# Altium project GBA.PrjPcb (part 4 of 4)

## Sheet [05] - Power.SchDoc
size A3; DocumentNumber: 6; SheetNumber: 5; SheetTotal: 9
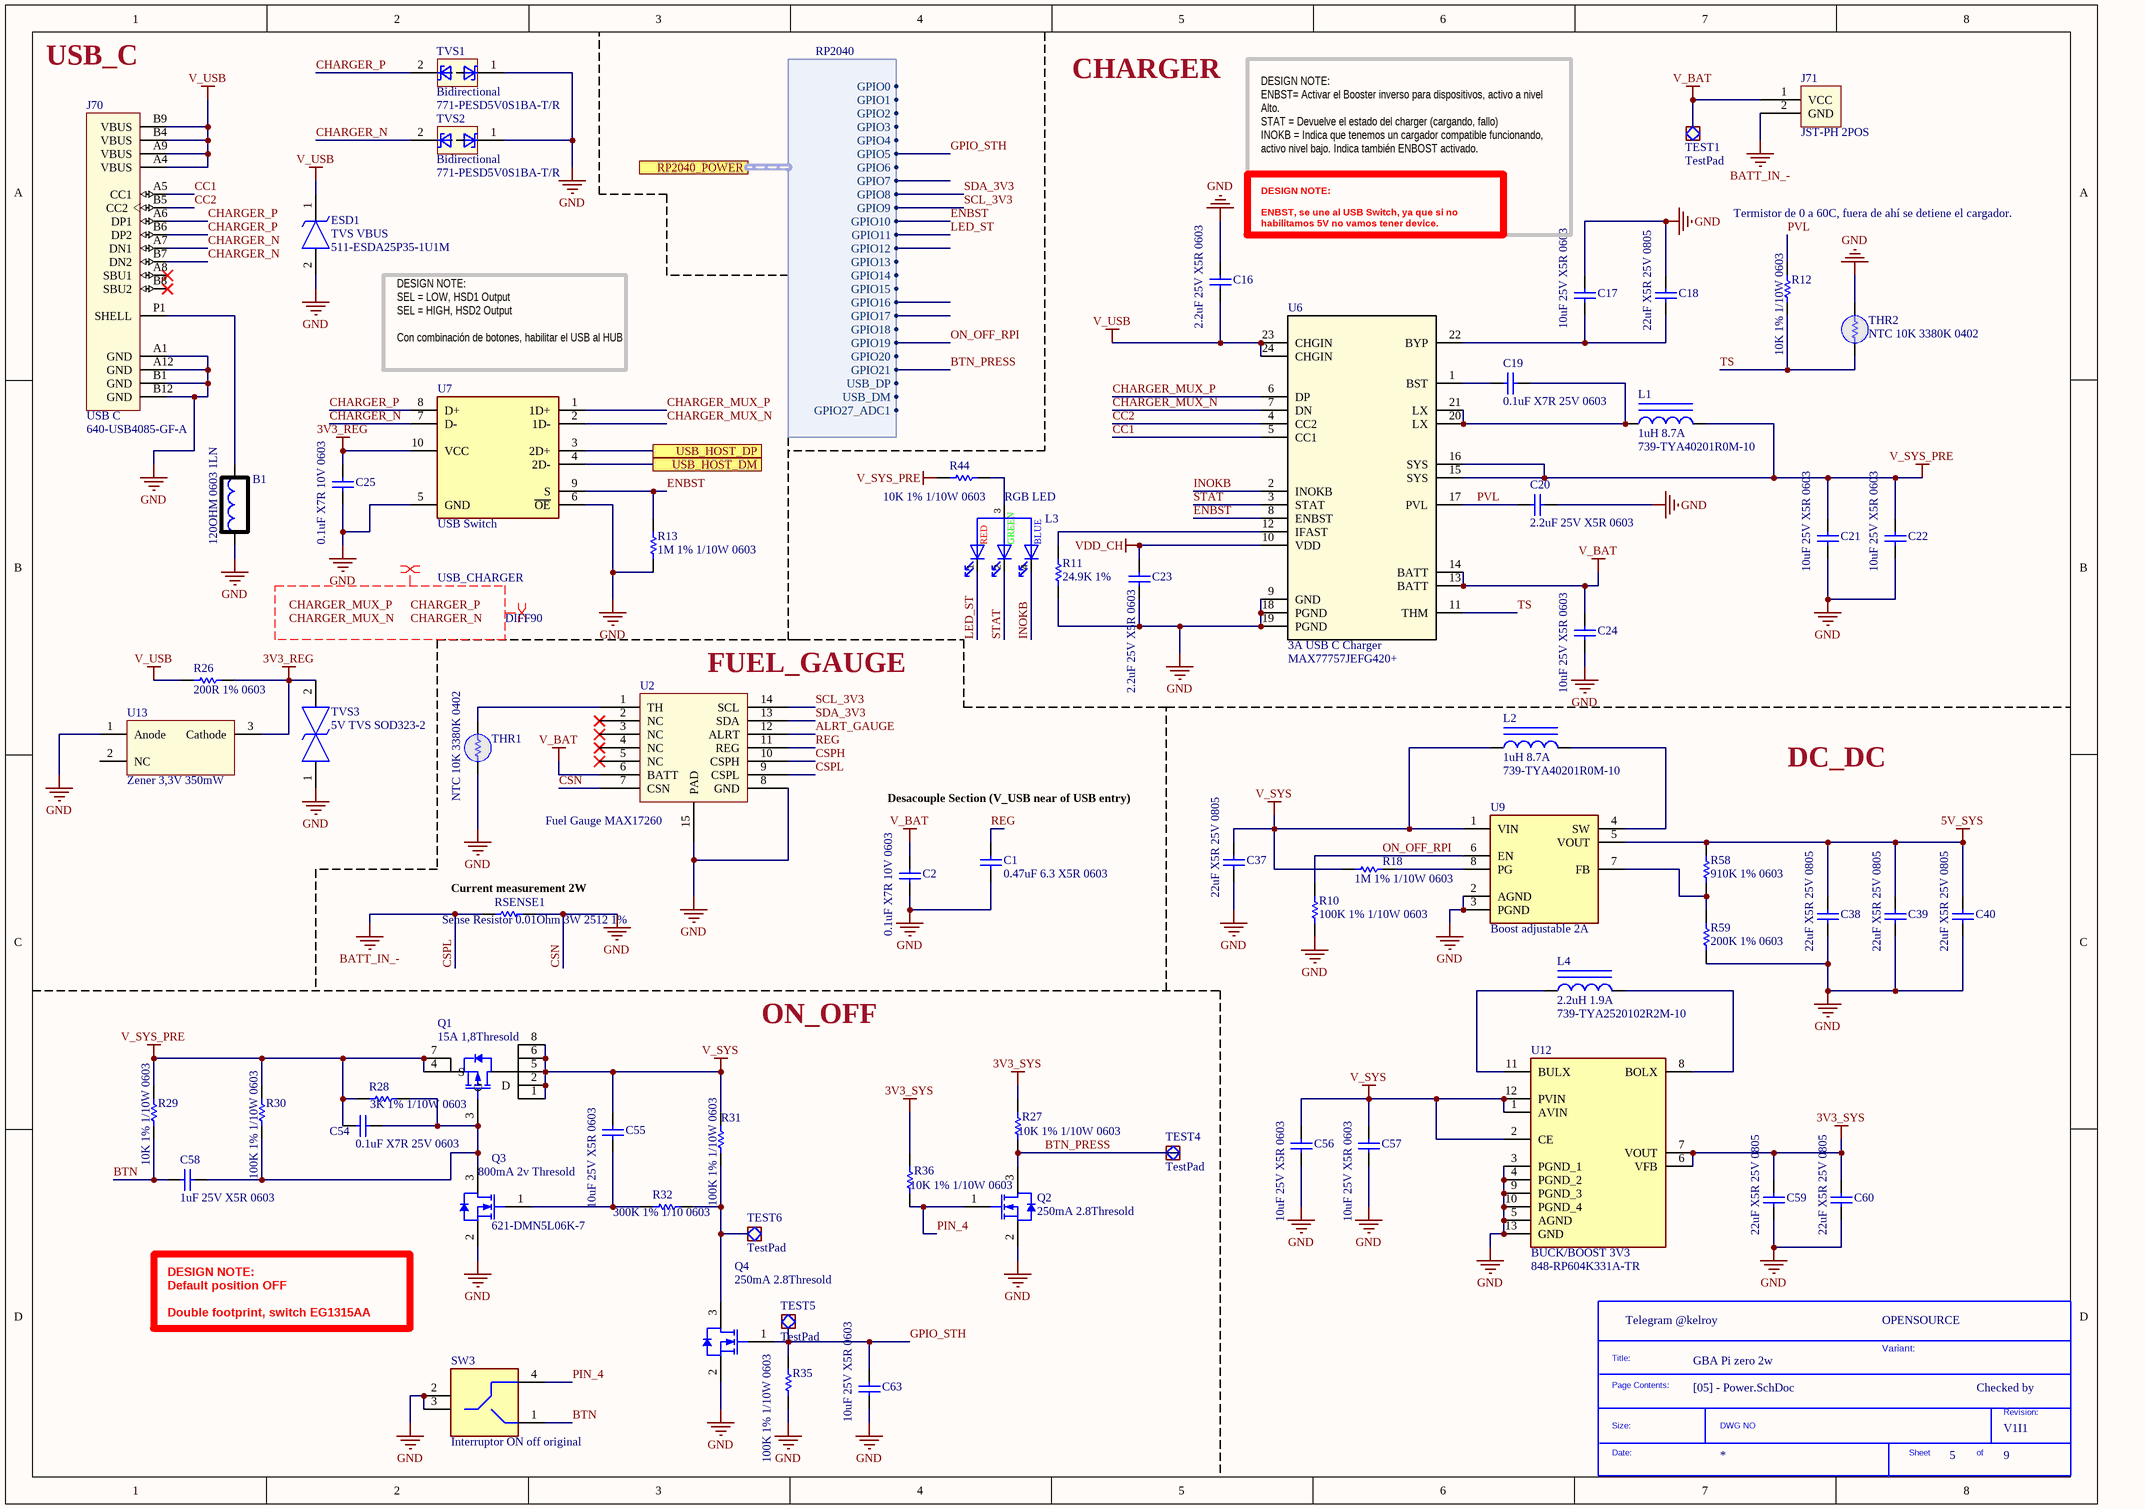
[diagram p8: [05] - Power.SchDoc]

### Parts
*?  SDTitleBlock  (value not drawn)  (graphical)
B1  120OHM 0603 1LN  [R 0603/1608]
C1  0.47uF 6.3 X5R 0603  [C 0603/1608]
C2  0.1uF X7R 10V 0603  [C 0603/1608]
C16  2.2uF 25V X5R 0603  [C 0603/1608]
C17  10uF 25V X5R 0603  [C 0603/1608]
C18  22uF X5R 25V 0805  [C 0805/2012]
C19  0.1uF X7R 25V 0603  [C 0603/1608]
C20  2.2uF 25V X5R 0603  [C 0603/1608]
C21  10uF 25V X5R 0603  [C 0603/1608]
C22  10uF 25V X5R 0603  [C 0603/1608]
C23  2.2uF 25V X5R 0603  [C 0603/1608]
C24  10uF 25V X5R 0603  [C 0603/1608]
C25  0.1uF X7R 10V 0603  [C 0603/1608]
C37  22uF X5R 25V 0805  [C 0805/2012]
C38  22uF X5R 25V 0805  [C 0805/2012]
C39  22uF X5R 25V 0805  [C 0805/2012]
C40  22uF X5R 25V 0805  [C 0805/2012]
C54  0.1uF X7R 25V 0603  [C 0603/1608]
C55  10uF 25V X5R 0603  [C 0603/1608]
C56  10uF 25V X5R 0603  [C 0603/1608]
C57  10uF 25V X5R 0603  [C 0603/1608]
C58  1uF 25V X5R 0603  [C 0603/1608]
C59  22uF X5R 25V 0805  [C 0805/2012]
C60  22uF X5R 25V 0805  [C 0805/2012]
C63  10uF 25V X5R 0603  [C 0603/1608]
ESD1  TVS VBUS  Supplier Part Number 1: 511-ESDA25P35-1U1M  [ESDA8P801U1M]
J70  USB C  Supplier Part Number 1: 640-USB4085-GF-A  [GCT_USB4085-GF-A_REVA]
J71  JST-PH 2POS  [S2B-PH]
L1  1uH 8.7A  Supplier Part Number 1: 739-TYA40201R0M-10  [TYA40201R0M10]
L2  1uH 8.7A  Supplier Part Number 1: 739-TYA40201R0M-10  [TYA40201R0M10]
L3  RGB LED  [IN-S66TATRGB]
L4  2.2uH 1.9A  Supplier Part Number 1: 739-TYA2520102R2M-10  [TYA2520102R2M10]
Q1  15A 1,8Thresold  [DMP1009UFDF-7]
Q2  250mA 2.8Thresold  [SOT-23-3]
Q3  800mA 2v Thresold  Supplier Part Number 1: 621-DMN5L06K-7  [SOT-23-3]
Q4  250mA 2.8Thresold  [SOT-23-3]
R10  100K 1% 1/10W 0603  [R 0603/1608]
R11  24.9K 1%  [R 0603/1608]
R12  10K 1% 1/10W 0603  [R 0603/1608]
R13  1M 1% 1/10W 0603  [R 0603/1608]
R18  1M 1% 1/10W 0603  [R 0603/1608]
R26  200R 1% 0603  [R 0603/1608]
R27  10K 1% 1/10W 0603  [R 0603/1608]
R28  3K 1% 1/10W 0603  [R 0603/1608]
R29  10K 1% 1/10W 0603  [R 0603/1608]
R30  100K 1% 1/10W 0603  [R 0603/1608]
R31  100K 1% 1/10W 0603  [R 0603/1608]
R32  300K 1% 1/10 0603  [R 0603/1608]
R35  100K 1% 1/10W 0603  [R 0603/1608]
R36  10K 1% 1/10W 0603  [R 0603/1608]
R44  10K 1% 1/10W 0603  [R 0603/1608]
R58  910K 1% 0603  [R 0603/1608]
R59  200K 1% 0603  [R 0603/1608]
RSENSE1  Sense Resistor 0.01Ohm 3W 2512 1%  [R2512]
SW3  Interruptor ON off original  [SWITCH_ORIGINAL]
TEST1  TestPad  [TestPad]  (no BOM)
TEST4  TestPad  [TestPad]  (no BOM)
TEST5  TestPad  [TestPad]  (no BOM)
TEST6  TestPad  [TestPad]  (no BOM)
THR1  NTC 10K 3380K 0402  [R 0402/1005]
THR2  NTC 10K 3380K 0402  [R 0402/1005]
TVS1  Bidirectional  Supplier Part Number 1: 771-PESD5V0S1BA-T/R  [SOD2512X110N]
TVS2  Bidirectional  Supplier Part Number 1: 771-PESD5V0S1BA-T/R  [SOD2512X110N]
TVS3  5V TVS SOD323-2  [SOD-323]
U2  Fuel Gauge MAX17260  [TDFN14-1.7X2.3MM]
U6  3A USB C Charger  [21-100385_90-100128_MXM]
U7  USB Switch  [NX3DV221GM115]
U9  Boost adjustable 2A  [MIC2877AYFTTR]
U12  BUCK/BOOST 3V3  Supplier Part Number 1: 848-RP604K331A-TR  [SON50P270X300X60-13N]
U13  Zener 3,3V 350mW  [SOT-23-3]

### Ports
RP2040_POWER (harness RP2040), USB_HOST_DM, USB_HOST_DP

### Harnesses
RP2040: GPIO0, GPIO1, GPIO2, GPIO3, USB_DP, USB_DM, GPIO27_ADC1, GPIO4, GPIO5, GPIO6, GPIO7, GPIO8, GPIO9, GPIO10, GPIO11, GPIO12, GPIO13, GPIO14, GPIO15, GPIO16, GPIO17, GPIO18, GPIO19, GPIO20, GPIO21

### Nets
3V3_REG: C25.1 R26.1 TVS3.2 U7.10(VCC) U13.3(Cathode)
3V3_SYS: C59.1 C60.1 R27.2 R36.2 U12.6(VFB) U12.7(VOUT)
5V_SYS: C38.1 C39.1 C40.1 R58.2 U9.5(VOUT)
CSN: B1.1 C1.1 C2.2 C16.1 C17.1 C18.1 C20.2 C21.2 C22.2 C23.2 C24.2 C25.2 C37.2 C38.2 C39.2 C40.2 C56.2 C57.2 C59.2 C60.2 C63.2 ESD1.2(A) J70.A1(GND) J70.A12(GND) J70.B1(GND) J70.B12(GND) Q2.2(S) Q3.2(S) Q4.2(S) R10.1 R11.1 R13.1 R35.1 R59.1 RSENSE1.2 SW3.2 SW3.3 THR1.2 THR2.2 TVS1.1(K1) TVS2.1(K1) TVS3.1 U2.7(CSN) U2.8(GND) U2.15(PAD) U6.9(GND) U6.18(PGND) U6.19(PGND) U7.5(GND) U7.6(~{OE}) U9.2(AGND) U9.3(PGND) U12.3(PGND_1) U12.4(PGND_2) U12.5(AGND) U12.9(PGND_3) U12.10(PGND_4) U12.13(GND) U13.1(Anode)  [also labelled GND]
CSPL: J71.2(GND) RSENSE1.1 U2.9(CSPL)  [also labelled BATT_IN_-]
V_BAT: C2.1 C24.1 J71.1(VCC) TEST1.1 U2.6(BATT) U6.13(BATT) U6.14(BATT)
V_SYS: C37.1 C55.1 C56.1 C57.1 L2.1 Q1.1(D) Q1.2(D) Q1.5(D) Q1.6(D) Q1.8(D) R18.2 R31.2 U9.1(VIN) U12.1(AVIN) U12.2(CE) U12.12(PVIN)
V_SYS_PRE: C21.1 C22.1 C54.2 L1.2 Q1.4(S) Q1.7(S) R28.2 R29.2 R30.2 R44.2 U6.15(SYS) U6.16(SYS)
V_USB: C16.2 ESD1.1(K) J70.A4(VBUS) J70.A9(VBUS) J70.B4(VBUS) J70.B9(VBUS) R26.2 U6.23(CHGIN) U6.24(CHGIN)
VDD_CH: C23.1 U6.10(VDD)
ALRT_GAUGE: U2.12(ALRT)
BTN: C58.1 R29.1 SW3.1
BTN_PRESS: Q2.3(D) R27.1 TEST4.1 ; port RP2040_POWER.GPIO21
CC1: J70.A5(CC1) U6.5(CC1)
CC2: J70.B5(CC2) U6.4(CC2)
CHARGER_MUX_N: U6.7(DN) U7.2(1D-)
CHARGER_MUX_P: U6.6(DP) U7.1(1D+)
CHARGER_N: J70.A7(DN1) J70.B7(DN2) TVS2.2(K2) U7.7(D-)
CHARGER_P: J70.A6(DP1) J70.B6(DP2) TVS1.2(K2) U7.8(D+)
CSPH: U2.10(CSPH)
ENBST: R13.2 U6.8(ENBST) U7.9(S) ; port RP2040_POWER.GPIO10
GPIO_STH: C63.1 Q4.1(G) R35.2 TEST5.1 ; port RP2040_POWER.GPIO5
INOKB: L3.4(K) U6.2(INOKB)
LED_ST: L3.1(K) ; port RP2040_POWER.GPIO11
ON_OFF_RPI: R10.2 U9.6(EN) ; port RP2040_POWER.GPIO19
PIN_4: Q2.1(G) R36.1 SW3.4
PVL: C20.1 R12.2 U6.17(PVL)
REG: C1.2 U2.11(REG)
SCL_3V3: U2.14(SCL) ; port RP2040_POWER.GPIO9  [project net RPI_GPIO9]
SDA_3V3: U2.13(SDA) ; port RP2040_POWER.GPIO8  [project net RPI_GPIO8]
STAT: L3.2(K) U6.3(STAT)
TS: R12.1 THR2.1 U6.11(THM)
USB_D2_N: U7.4(2D-) ; port USB_HOST_DM
USB_D2_P: U7.3(2D+) ; port USB_HOST_DP
NetB1_2: B1.2 J70.P1(SHELL)
NetC17_2: C17.2 C18.2 U6.22(BYP)
NetC19_1: C19.1 U6.1(BST)
NetC19_2: C19.2 L1.1 U6.20(LX) U6.21(LX)
NetC54_1: C54.1 C58.2 Q1.3(G) Q3.3(D) R28.1 R30.1
NetC55_2: C55.2 Q3.1(G) R32.2
NetL2_2: L2.2 U9.4(SW)
NetL3_3: L3.3(A) R44.1
NetL4_1: L4.1 U12.11(BULX)
NetL4_2: L4.2 U12.8(BOLX)
NetQ4_3: Q4.3(D) R31.1 R32.1 TEST6.1
NetR11_2: R11.2 U6.12(IFAST)
NetR18_1: R18.1 U9.8(PG)
NetR58_1: R58.1 R59.2 U9.7(FB)
NetTHR1_1: THR1.1 U2.1(TH)

Not connected (* = marked no-connect by the designer): J70 A8(SBU1)* B8(SBU2)*; U2 2(NC)* 3(NC)* 4(NC)* 5(NC)*; U13 2(NC)

### Layout directives
net class USB_CHARGER; rule Differential Pairs Routing [Pref Gap = 0.18mm    Min Gap  = 0.18mm    Max Gap  = 0.18mmPref Width = 0.15mm    Min Width  = 0.15mm    Max Width  = 0.15mm]: CHARGER_MUX_N, CHARGER_MUX_P, CHARGER_N, CHARGER_P
differential pair; net class DIFF90: CHARGER_MUX_N, CHARGER_MUX_P, CHARGER_N, CHARGER_P

### Notes on the sheet
- USB_C
- CHARGER
- DESIGN NOTE:
  ENBST= Activar el Booster inverso para dispositivos, activo a nivel Alto.
  STAT = Devuelve el estado del charger (cargando, fallo)
  INOKB = Indica que tenemos un cargador compatible funcionando, activo nivel bajo. Indica también ENBOST activado.
- DESIGN NOTE:
  ENBST, se une al USB Switch, ya que si no habilitamos 5V no vamos tener device.
- Termistor de 0 a 60C, fuera de ahí se detiene el cargador.
- DESIGN NOTE:
  SEL = LOW, HSD1 Output
  SEL = HIGH, HSD2 Output
  Con combinación de botones, habilitar el USB al HUB
- (near U2) FUEL_GAUGE
- DC_DC
- Desacouple Section (V_USB near of USB entry)
- (near RSENSE1) Current measurement 2W
- ON_OFF
- DESIGN NOTE:
  Default position OFF
  Double footprint, switch EG1315AA
- OPENSOURCE
- Variant:
- Checked by
- Labels drawn without touching a wire or pin: CHARGER_MUX_N, CHARGER_MUX_P, CHARGER_N, CHARGER_P
- (in symbol IN-S66TATRGB) RED; GREEN; BLUE
- (in symbol SDTitleBlock) Title:; Page Contents:; Revision:; Size:; DWG NO; Date:; Sheet; of

### Library data of the parts
B1 = MMZ1608B121CTAH0: FERRITE BEAD 120 OHM 0603 1LN; Manufacturer: TDK Corporation; Filter Type: Signal Line; Current Rating (Max): 600mA; DC Resistance (DCR) (Max): 150 mOhm; Supplier 1: Digi-Key; Manufacturer Part Number: MMZ1608B121CTAH0; RoHS: RoHS Compliant; Category: Filters; Stock 1: 139504; Pricing 1: 1=0.09, 10=0.062, 25=0.056, 50=0.0504, 100=0.0371, 250=0.02692, 500=0.02468, 1000=0.02132 (EUR); Packaging: Cut Tape (CT); Part Status: Active; Ratings: -; Operating Temperature: -55°C ~ 125°C; Package / Case: 0603 (1608 Metric); Mounting Type: Surface Mount; Height (Max): 0.030" (0.75mm); Size / Dimension: 0.063" L x 0.032" W (1.60mm x 0.80mm); ComponentLink1URL: https://product.tdk.com/info/en/catalog/datasheets/beads_commercial_signal_mmz1608_en.pdf; ComponentLink1Description: https://product.tdk.com/info/en/catalog/datasheets/beads_commercial_signal_mmz1608_en.pdf; Supplier Part Number 1: 445-2164-1-ND
C1 = GRM188R60J474KA01D: CAP CER 0.47UF 6.3V X5R 0603; Manufacturer: Murata Electronics North America; Tolerance: ±10%; Notification: Current market demand for these product types have resulted in fluctuating and extending lead times. Lead times may differ.; Supplier 1: Digi-Key; Manufacturer Part Number: GRM188R60J474KA01D; RoHS: RoHS Compliant; Category: Capacitors; Stock 1: 40000; Pricing 1: 1=0.13, 10=0.092, 100=0.0467, 500=0.032, 1000=0.0283 (GBP); Packaging: Cut Tape (CT); Part Status: Not For New Designs; Voltage - Rated: 6.3V; Temperature Coefficient: X5R; Operating Temperature: -55°C ~ 85°C; Features: -; Ratings: -; Applications: General Purpose; Mounting Type: Surface Mount, MLCC; Package / Case: 0603 (1608 Metric); Size / Dimension: 0.063" L x 0.031" W (1.60mm x 0.80mm); Height - Seated (Max): -; Thickness (Max): 0.035" (0.90mm); Lead Spacing: -; Lead Style: -; ComponentLink1URL: https://www.murata.com/~/media/webrenewal/support/library/catalog/products/capacitor/mlcc/c02e.ashx?la=en-us; ComponentLink1Description: https://www.murata.com/~/media/webrenewal/support/library/catalog/products/capacitor/mlcc/c02e.ashx?la=en-us; Supplier Part Number 1: 490-1548-1-ND
C2 C25 = CC0603KRX7R6BB104: Multilayer Ceramic Capacitors MLCC - SMD/SMT 100nF 10V X7R 10%; Manufacturer: Yageo; Supplier 1: Mouser; Manufacturer Part Number: CC0603KRX7R6BB104; Stock 1: 15698; Pricing 1: 1=0.12, 10=0.06, 50=0.06, 100=0.027, 1000=0.022, 10000=0.016 (USD); Mount: Surface Mount; Case/Package: 0603; Weight: 7.1E-05oz; Case Code (Imperial): 0603; Case Code (Metric): 1608; Min Operating Temperature: -55°C; Max Operating Temperature: 125°C; Capacitance: 100nF; Tolerance: 10%; Dielectric: X7R; Voltage Rating: 10V; Voltage Rating (DC): 10V; Packaging: Tape and Reel; Termination: SMD/SMT; Composition: Ceramic; Length: 1.6mm; Height: 0.8mm; Width: 0.8mm; Thickness: 0.035inch; Depth: 0.8mm; Radiation Hardening: No; Lead Free: Lead Free; Halogen Free: Halogen Free; ComponentLink1URL: http://www.yageo.com/documents/recent/UPY-GPHC_X7R_6.3V-to-50V_8.pdf; ComponentLink1Description: http://www.yageo.com/documents/recent/UPY-GPHC_X7R_6.3V-to-50V_8.pdf; Supplier Part Number 1: 603-CC603KRX7R6BB104
C16 C20 C23 = GRM188R61E225MA12D: CAP CER 2.2UF 25V X5R 0603; Manufacturer 1: Murata; Tolerance: 20%; Supplier 1: Mouser; Manufacturer Part Number 1: GRM188R61E225MA12D; Stock 1: 103424; Pricing 1: 1=0,16000, 10=0,11500, 50=0,11500, 100=0,05400, 1000=0,03200, 10000=0,02300 (USD); RoHS: Yes; Mount: Surface Mount; Case/Package: 0603; Weight: 0.000222oz; Case Code (Metric): 1608; Case Code (Imperial): 0603; Min Operating Temperature: -55°C; Max Operating Temperature: 85°C; Capacitance: 2.2uF; Packaging: Tape and Reel; Voltage Rating: 25V; Dielectric: X5R; Termination: SMD/SMT; Composition: Ceramic; Voltage Rating (DC): 25V; Package Quantity: 4000; Length: 0.063inch; Height: 0.8mm; Width: 0.031inch; Thickness: 0.035inch; ComponentLink1URL: http://www.mouser.com/ds/2/281/c02e-2905.pdf?src-supplier=Mouser; ComponentLink1Description: http://www.mouser.com/ds/2/281/c02e-2905.pdf?src-supplier=Mouser; ComponentLink2URL: http://search.murata.co.jp/Ceramy/image/img/A01X/G101/ENG/GRM188R61E225MA12-01.pdf?src-supplier=Digi-Key; ComponentLink2Description: http://search.murata.co.jp/Ceramy/image/img/A01X/G101/ENG/GRM188R61E225MA12-01.pdf?src-supplier=Digi-Key; Supplier Part Number 1: 81-GRM188R61E225MA2D
C17 C21 C22 C24 C55-C57 C63 = GRM188R61E106KA73D: Cap Ceramic 10uF 25V X5R 10% SMD 0603 85°C Paper T/R; Manufacturer 1: Murata; Supplier 1: Mouser; Manufacturer Part Number 1: GRM188R61E106KA73D; Stock 1: 265910; Pricing 1: 1=0.37000, 10=0.25900, 50=0.25900, 100=0.15500, 500=0.11600, 1000=0.09800, 4000=0.07600, 8000=0.07000, 10000=0.07000, 12000=0.06300 (USD); RoHS: No; Case/Package: 0603; Supplier Part Number 1: 81-GRM188R61E106KA3D
C18 C37-C40 C59 C60 = GRM21BR61E226ME44K: Multilayer Ceramic Capacitors MLCC - SMD/SMT; Manufacturer: Murata; Tolerance: 20%; Supplier 1: Mouser; Manufacturer Part Number: GRM21BR61E226ME44K; Stock 1: 50478; Pricing 1: 1=0.54, 10=0.383, 50=0.383, 100=0.252, 1000=0.159, 10000=0.148 (USD); Mount: Surface Mount; Case/Package: 0805; Weight: 0.000335oz; Case Code (Imperial): 0805; Case Code (Metric): 2012; Min Operating Temperature: -55°C; Max Operating Temperature: 85°C; Packaging: Tape and Reel; Capacitance: 22uF; Voltage Rating: 25V; Dielectric: X5R; Termination: SMD/SMT; Composition: Ceramic; Voltage Rating (DC): 25V; Package Quantity: 10000; Length: 0.079inch; Height: 1.25mm; Width: 1.25mm; Thickness: 0.057inch; Supplier Part Number 1: 81-GRM21BR61E226ME4K
C19 C54 = 885012206071: WURTH ELEKTRONIK         885012206071             SMD Multilayer Ceramic Capacitor, 0603 [1608 Metric], 0.1 F, 25 V,  10%, X7R, WCAP-CSGP Series; Manufacturer: Wurth Electronics; Capacitance: 100nF; Supplier 1: Mouser; Manufacturer Part Number: 885012206071; Stock 1: 202580; Pricing 1: 1=0.1, 10=0.046, 50=0.046, 100=0.041, 1000=0.036, 10000=0.036 (USD); Mount: Surface Mount; Case/Package: 0603; Case Code (Metric): 1608; Case Code (Imperial): 0603; Min Operating Temperature: -55°C; Max Operating Temperature: 125°C; Packaging: Cut Tape; Voltage Rating: 25V; Dielectric: X7R; Tolerance: 10%; Voltage Rating (DC): 25V; Length: 0.063inch; Width: 0.031inch; Thickness: 0.037inch; REACH SVHC: Unknown; Supplier Part Number 1: 710-885012206071
C58 = CC0603KRX5R8BB105: CAP CER 1UF 25V X5R 0603; Manufacturer: Yageo; Tolerance: 10%; Supplier 1: Mouser; Manufacturer Part Number: CC0603KRX5R8BB105; RoHS: Yes; Stock 1: 9605452; Pricing 1: 1 = 0,10000, 10 = 0,04700, 50 = 0,04700, 100 = 0,01700, 1000 = 0,01600, 10000 = 0,00800 (USD); Mount: Surface Mount; Case/Package: 0603; Number of Pins: 2; Case Code (Metric): 1608; Case Code (Imperial): 0603; Min Operating Temperature: -55°C; Max Operating Temperature: 85°C; Capacitance: 1uF; Dielectric: X5R; Package Quantity: 1; Voltage Rating: 25V; Packaging: Tape and Reel; Termination: SMD/SMT; Voltage Rating (DC): 25V; Length: 1.6mm; Height: 0.8mm; Width: 0.031inch; Thickness: 0.035inch; Depth: 0.8mm; Radiation Hardening: No; REACH SVHC: No SVHC; Lead Free: Lead Free; Halogen Free: Halogen Free; ComponentLink1URL: https://datasheet.ciiva.com/176/mlccorderingcode-176785.pdf?src-supplier=Digi-Key; ComponentLink1Description: https://datasheet.ciiva.com/176/mlccorderingcode-176785.pdf?src-supplier=Digi-Key; ComponentLink2URL: https://datasheet.ciiva.com/176/mlccorderingcode-176786.pdf?src-supplier=Digi-Key; ComponentLink2Description: https://datasheet.ciiva.com/176/mlccorderingcode-176786.pdf?src-supplier=Digi-Key; ComponentLink3URL: https://datasheet.ciiva.com/176/mlccorderingcode-176787.pdf?src-supplier=Digi-Key; ComponentLink3Description: https://datasheet.ciiva.com/176/mlccorderingcode-176787.pdf?src-supplier=Digi-Key; ComponentLink4URL: https://datasheet.ciiva.com/17436/upy-gphc-x5r-4v-to-50v-12-17436952.pdf?src-supplier=Avnet+Europe; ComponentLink4Description: https://datasheet.ciiva.com/17436/upy-gphc-x5r-4v-to-50v-12-17436952.pdf?src-supplier=Avnet+Europe; ComponentLink5URL: https://datasheet.ciiva.com/7978/1525783-7978171.pdf?src-supplier=Element14; ComponentLink5Description: https://datasheet.ciiva.com/7978/1525783-7978171.pdf?src-supplier=Element14; ComponentLink6URL: https://datasheet.ciiva.com/11586/upy-gphc-x5r-4v-to-50v-12-11586318.pdf?src-supplier=Avnet; ComponentLink6Description: https://datasheet.ciiva.com/11586/upy-gphc-x5r-4v-to-50v-12-11586318.pdf?src-supplier=Avnet; Supplier Part Number 1: 603-CC603KRX5R8BB105
ESD1 = ESDA25P35-1U1M: STMICROELECTRONICS - ESDA25P35-1U1M - ESD Protection Device, Unidirectional, 41 V, QFN, 2 Pins; Number of Unidirectional Channels: 1; Reverse Standoff Voltage: 22V; Min Breakdown Voltage: 23.3V; Clamping Voltage: 41V; Peak Pulse Current: 35A; Peak Pulse Power: 1.4kW; Power Line Protection: No; Supplier 1: Mouser; Manufacturer: STMicroelectronics; Manufacturer Part Number: ESDA25P35-1U1M; RoHS: Yes; Category: TVS Diodes; Stock 1: 23753; Mount: Surface Mount; Case/Package: 1610; Number of Pins: 2; Min Operating Temperature: -55°C; Max Operating Temperature: 150°C; Resistor Type: Zener; Packaging: Tape and Reel; RoHS Compliant: Yes; ComponentLink1URL: http://www.farnell.com/datasheets/2236209.pdf?src-supplier=Farnell; ComponentLink1Description: http://www.farnell.com/datasheets/2236209.pdf?src-supplier=Farnell; ComponentLink2URL: http://www.st.com/content/ccc/resource/technical/document/datasheet/group3/e4/43/53/b9/4e/8a/40/bb/DM00312034/files/DM00312034.pdf/jcr:content/translations/en.DM00312034.pdf?src-supplier=Digi-Key; ComponentLink2Description: http://www.st.com/content/ccc/resource/technical/document/datasheet/group3/e4/43/53/b9/4e/8a/40/bb/DM00312034/files/DM00312034.pdf/jcr:content/translations/en.DM00312034.pdf?src-supplier=Digi-Key; ComponentLink3URL: http://www.farnell.com/datasheets/2236209.pdf?src-supplier=Element14; ComponentLink3Description: http://www.farnell.com/datasheets/2236209.pdf?src-supplier=Element14; ComponentLink4URL: http://www.farnell.com/datasheets/2236209.pdf?src-supplier=Newark; ComponentLink4Description: http://www.farnell.com/datasheets/2236209.pdf?src-supplier=Newark
J70 = USB4085-GF-A: USB4085 Series 20 V PCB Top Mount USB 2.0 Type C Receptacle; Manufacturer: Global Connector Technology; USB Standard: USB 2.0; Number of Positions: 16; Supplier 1: Mouser; Manufacturer Part Number: USB4085-GF-A; RoHS: Yes; Category: USB Connectors; Contact Material: Copper Alloy; Contact Plating: Gold; Gender: Receptacle; Orientation: Right Angle; ComponentLink1URL: https://datasheet.ciiva.com/71788/2674755-71788146.pdf?src-supplier=Element14; ComponentLink1Description: https://datasheet.ciiva.com/71788/2674755-71788146.pdf?src-supplier=Element14; ComponentLink2URL: https://datasheet.ciiva.com/71788/usb4085-71788147.pdf?src-supplier=Digi-Key; ComponentLink2Description: https://datasheet.ciiva.com/71788/usb4085-71788147.pdf?src-supplier=Digi-Key
J71 = S2B-PH-K-S(LF)(SN): CONN HEADER R/A 2POS 2MM; Manufacturer: JST Sales America Inc.; Pitch - Mating: 0.079" (2.00mm); Number of Positions: 2; Number of Positions Loaded: All; Style: Board to Cable/Wire; Shrouding: Shrouded - 4 Wall; Contact Length - Mating: 0.130" (3.30mm); Contact Length - Post: 0.134" (3.40mm); Material Flammability Rating: UL94 V-0; Current Rating: 2A; Voltage Rating: 100V; Supplier 1: Digi-Key; Manufacturer Part Number: S2B-PH-K-S(LF)(SN); RoHS: RoHS Compliant; Category: Connectors, Interconnects; Stock 1: 201097; Pricing 1: 1=0.13, 10=0.127, 100=0.078, 500=0.06454, 1000=0.05647, 5000=0.0484, 10000=0.04706 (GBP); Packaging: Bulk; Part Status: Active; Connector Type: Header; Contact Type: Male Pin; Number of Rows: 1; Row Spacing - Mating: -; Mounting Type: Through Hole, Right Angle; Termination: Press-Fit, Solder; Fastening Type: Detent Lock; Overall Contact Length: -; Insulation Height: 0.189" (4.80mm); Contact Shape: Square; Contact Finish - Mating: Tin; Contact Finish Thickness - Mating: -; Contact Finish - Post: Tin; Contact Material: Brass; Insulation Material: Polyamide (PA66), Nylon 6/6; Features: -; Operating Temperature: -25°C ~ 85°C; Ingress Protection: -; Insulation Color: Natural; Mated Stacking Heights: -; Contact Finish Thickness - Post: -; Applications: -; ComponentLink1URL: http://www.jst-mfg.com/product/pdf/eng/ePH.pdf; ComponentLink1Description: http://www.jst-mfg.com/product/pdf/eng/ePH.pdf; Supplier Part Number 1: 455-1719-ND
L1 L2 = TYA40201R0M-10: Inductores fijos 1uH 8.7A 20% Wire Wound; Manufacturer: Laird; Supplier 1: Mouser; Manufacturer Part Number: TYA40201R0M-10; RoHS: No; Stock 1: 11697
L3 = IN-S66TATRGB: LED Tri-Color Blue/Green/Red 470nm/530nm/630nm Automotive 4-Pin SMD T/R; Manufacturer: Inolux; Color: Blue,Green,Red; Lens Color: Clear; Lens Style: Flat; Element Configuration: Common Anode; Luminous Intensity: 110mcd; Forward Voltage: 3.2V; Test Current: 20mA; Viewing Angle: 120°; Dominant Wavelength: 468nm; Lens Size: 1.15mm; Supplier 1: Mouser; Manufacturer Part Number: IN-S66TATRGB; RoHS: No; Category: LEDs; Stock 1: 12490; Pricing 1: 1=0,42000, 10=0,26300, 50=0,26300, 100=0,15400, 1000=0,12100, 10000=0,09600 (USD); Mount: Surface Mount; Case/Package: 0606; Case Code (Imperial): 0606; Case Code (Metric): 1616; Packaging: Cut Tape; Lens Transparency: Clear; Length: 1.6mm; Width: 1.5mm; Height: 0.55mm; ComponentLink1URL: http://www.inolux-corp.com/datasheet/SMDLED/RGB%20Top%20View/IN-S66TATRGB_V1.0.pdf?src-supplier=Digi-Key; ComponentLink1Description: http://www.inolux-corp.com/datasheet/SMDLED/RGB%20Top%20View/IN-S66TATRGB_V1.0.pdf?src-supplier=Digi-Key; Supplier Part Number 1: 743-IN-S66TATRGB
L4 = TYA2520102R2M-10: Inductores fijos 2.2uH 1.9A 20% Wire Wound; Manufacturer: Laird; Supplier 1: Mouser; Manufacturer Part Number: TYA2520102R2M-10; RoHS: No; Stock 1: 6663
Q1 = DMP1009UFDF-7: MOSFET P-CH 12V 15A UDFN2020-6; Manufacturer: Diodes; Supplier 1: Mouser; Manufacturer Part Number: DMP1009UFDF-7; RoHS: No; Stock 1: 2267; Pricing 1: 1 = 0,43000, 10 = 0,36100, 50 = 0,36100, 100 = 0,22000, 1000 = 0,17000, 10000 = 0,14500 (USD); ComponentLink1URL: https://www.diodes.com/assets/Datasheets/DMP1009UFDF.pdf?src-supplier=Digi-Key; ComponentLink1Description: https://www.diodes.com/assets/Datasheets/DMP1009UFDF.pdf?src-supplier=Digi-Key; Supplier Part Number 1: 621-DMP1009UFDF-7
Q2 Q4 = RK7002BMT116: MOSFET N-CH 60V 0.25A SST3; Manufacturer: Rohm; Rds On Max: 2.4R; Input Capacitance: 15pF; Max Power Dissipation: 200mW; Number of Channels: 1; Drain to Source Resistance: 1.7R; Gate to Source Voltage (Vgs): 20V; Fall Time: 28ns; Rise Time: 5ns; Turn-Off Delay Time: 18ns; Turn-On Delay Time: 3.5ns; FET Type: 1 N-Channel; Supplier 1: Mouser; Manufacturer Part Number: RK7002BMT116; Stock 1: 237072; Pricing 1: 1=0.15, 10=0.133, 50=0.133, 100=0.047, 1000=0.031, 10000=0.021 (USD); Mount: Surface Mount; Case/Package: TO-236-3; Max Operating Temperature: 150°C; Package Quantity: 3000; Packaging: Tape and Reel; Drain to Source Voltage (Vdss): 60V; Continuous Drain Current (ID): 250mA; Drain to Source Breakdown Voltage: 60V; Lead Free: Lead Free; Supplier Part Number 1: 755-RK7002BMT116
Q3 = RK7002BMT116: MOSFET N-CH 60V 0.25A SST3; Manufacturer: Diodes; Manufacturer Part Number: DMN5L06K-7; Rds On Max: 2.4R; Input Capacitance: 15pF; Continuous Drain Current (ID): 250mA; Max Power Dissipation: 200mW; Number of Channels: 1; Drain to Source Resistance: 1.7R; Gate to Source Voltage (Vgs): 20V; Fall Time: 28ns; Rise Time: 5ns; Turn-Off Delay Time: 18ns; Turn-On Delay Time: 3.5ns; FET Type: 1 N-Channel; Stock 1: 237072; Pricing 1: 1=0.15, 10=0.133, 50=0.133, 100=0.047, 1000=0.031, 10000=0.021 (USD); Mount: Surface Mount; Case/Package: TO-236-3; Max Operating Temperature: 150°C; Package Quantity: 3000; Packaging: Tape and Reel; Drain to Source Voltage (Vdss): 60V; Drain to Source Breakdown Voltage: 60V; Lead Free: Lead Free; Supplier 1: Mouser
R10 R30 R31 R35 = RC0603FR-07100KL: RES SMD 100K OHM 1% 1/10W 0603; Manufacturer: Yageo; Power (Watts): 0.1W, 1/10W; Temperature Coefficient: ±100ppm/°C; Supplier 1: Digi-Key; Manufacturer Part Number: RC0603FR-07100KL; RoHS: RoHS Compliant; Category: Resistors; Stock 1: 6298016; Pricing 1: 1=0.08, 10=0.013, 100=0.005, 1000=0.00224, 2500=0.00195 (EUR); Packaging: Cut Tape (CT); Part Status: Active; Tolerance: ±1%; Composition: Thick Film; Features: Moisture Resistant; Operating Temperature: -55°C ~ 155°C; Package / Case: 0603 (1608 Metric); Supplier Device Package: 0603; Size / Dimension: 0.063" L x 0.032" W (1.60mm x 0.80mm); Height - Seated (Max): 0.022" (0.55mm); Failure Rate: -; ComponentLink1URL: http://www.yageo.com/documents/recent/PYu-RC_Group_51_RoHS_L_8.pdf; ComponentLink1Description: http://www.yageo.com/documents/recent/PYu-RC_Group_51_RoHS_L_8.pdf; Supplier Part Number 1: 311-100KHRCT-ND
R11 = RC0603FR-1024K9L: Res Thick Film 0603 24.9K Ohm 1% 1/10W ±100ppm/°C Molded SMD SMD Paper T/R; Manufacturer: Yageo; Resistance: 24.9kR; Supplier 1: Mouser; Manufacturer Part Number: RC0603FR-1024K9L; RoHS: Yes; Category: Chip SMD Resistors; Stock 1: 17782; Pricing 1: 1=0,10000, 10=0,01800, 50=0,01800, 100=0,00600, 1000=0,00500, 10000=0,00200 (USD); Case/Package: 0603; Contact Plating: Tin,Matte; Min Operating Temperature: -55°C; Max Operating Temperature: 155°C; Tolerance: 1%; Resistor Type: Thick Film; Temperature Coefficient: 100ppm/°C; Radiation Hardening: No; RoHS Compliant: Yes; ComponentLink1URL: http://www.yageo.com/documents/recent/PYu-RC0603_51_RoHS_L_5.pdf?src-supplier=Avnet+Europe; ComponentLink1Description: http://www.yageo.com/documents/recent/PYu-RC0603_51_RoHS_L_5.pdf?src-supplier=Avnet+Europe; ComponentLink2URL: http://www.yageo.com/documents/recent/PYu-RC_Group_51_RoHS_L_2.pdf?src-supplier=Avnet; ComponentLink2Description: http://www.yageo.com/documents/recent/PYu-RC_Group_51_RoHS_L_2.pdf?src-supplier=Avnet; Supplier Part Number 1: 603-RC0603FR-1024K9L
R12 R27 R29 R36 R44 = RC0603FR-0710KL: RES SMD 10K OHM 1% 1/10W 0603; Manufacturer: Yageo; Power (Watts): 0.1W, 1/10W; Temperature Coefficient: ±100ppm/°C; Supplier 1: Digi-Key; Manufacturer Part Number: RC0603FR-0710KL; RoHS: RoHS Compliant; Category: Resistors; Stock 1: 47851285; Pricing 1: 1=0.08, 10=0.013, 100=0.005, 1000=0.00224, 2500=0.00195 (EUR); Packaging: Cut Tape (CT); Part Status: Active; Tolerance: ±1%; Composition: Thick Film; Features: Moisture Resistant; Operating Temperature: -55°C ~ 155°C; Package / Case: 0603 (1608 Metric); Supplier Device Package: 0603; Size / Dimension: 0.063" L x 0.032" W (1.60mm x 0.80mm); Height - Seated (Max): 0.022" (0.55mm); Failure Rate: -; ComponentLink1URL: http://www.yageo.com/documents/recent/PYu-RC_Group_51_RoHS_L_8.pdf; ComponentLink1Description: http://www.yageo.com/documents/recent/PYu-RC_Group_51_RoHS_L_8.pdf; Supplier Part Number 1: 311-10.0KHRCT-ND
R13 R18 = RC0603FR-071ML: RES SMD 1M OHM 1% 1/10W 0603; Manufacturer 1: Yageo; Voltage Rating: 50V; Resistance: 1MR; Power Rating: 100mW; Temperature Coefficient: 100ppm/°C; Supplier 1: Digi-Key; Manufacturer Part Number 1: RC0603FR-071ML; Stock 1: 9751331; Pricing 1: 1=0,10000, 10=0,02400, 100=0,00970, 1000=0,00437, 2500=0,00379 (USD); RoHS: Yes; Case/Package: 0603; Number of Pins: 2; Case Code (Imperial): 0603; Case Code (Metric): 1608; Min Operating Temperature: -55°C; Max Operating Temperature: 155°C; Voltage Rating (DC): 50V; Tolerance: 1%; Packaging: Tape and Reel; Package Quantity: 5000; Termination: SMD/SMT; Composition: Thick Film; Military Standard: Not; Length: 1.6mm; Height: 0.45mm; Width: 0.8mm; Depth: 0.8mm; REACH SVHC: No SVHC; Lead Free: Lead Free; ComponentLink1URL: https://datasheet.ciiva.com/11819/0900766b80f96399-11819295.pdf?src-supplier=RSComponents; ComponentLink1Description: https://datasheet.ciiva.com/11819/0900766b80f96399-11819295.pdf?src-supplier=RSComponents; ComponentLink2URL: https://datasheet.ciiva.com/7983/443971-7983614.pdf?src-supplier=Element14; ComponentLink2Description: https://datasheet.ciiva.com/7983/443971-7983614.pdf?src-supplier=Element14; ComponentLink3URL: https://datasheet.ciiva.com/12555/rc0603-272842-12555388.pdf?src-supplier=Mouser; ComponentLink3Description: https://datasheet.ciiva.com/12555/rc0603-272842-12555388.pdf?src-supplier=Mouser; Supplier Part Number 1: 311-1.00MHRDKR-ND
R26 = RC0603FR-07200RL: RES SMD 200 OHM 1% 1/10W 0603; Manufacturer: Yageo; Power Rating: 100mW; Voltage Rating: 50V; Temperature Coefficient: 100ppm/°C; Working Voltage: 75V; Supplier 1: Mouser; Manufacturer Part Number: RC0603FR-07200RL; RoHS: Yes; Category: Chip SMD Resistors; Stock 1: 516076; Pricing 1: 1=0,10000, 10=0,01700, 50=0,01700, 100=0,00700, 1000=0,00400, 10000=0,00200 (USD); Case/Package: 0603; Number of Pins: 2; Case Code (Imperial): 0603; Case Code (Metric): 1608; Min Operating Temperature: -55°C; Max Operating Temperature: 155°C; Packaging: Tape and Reel; Resistance: 200R; Tolerance: 1%; Package Quantity: 5000; Termination: SMD/SMT; Resistor Type: Thick Film; Voltage Rating (DC): 50V; Number of Terminations: 2; Features: Moisture Resistant; Series: RC; Max Power Dissipation: 100mW; Resistance Tolerance: 1%; Construction: Rectangular; Technology: THICK FILM; Length: 1.6mm; Width: 0.8mm; Height: 0.45mm; Depth: 0.8mm; Reach SVHC Compliant: Yes; Military Standard: Not; Lead Free: Lead Free; RoHS Compliant: Yes; ComponentLink1URL: https://datasheet.ciiva.com/11809/0900766b80f96399-11809240.pdf?src-supplier=RSComponents; ComponentLink1Description: https://datasheet.ciiva.com/11809/0900766b80f96399-11809240.pdf?src-supplier=RSComponents; ComponentLink2URL: https://datasheet.ciiva.com/46395/443971-46395029.pdf?src-supplier=Element14; ComponentLink2Description: https://datasheet.ciiva.com/46395/443971-46395029.pdf?src-supplier=Element14; Supplier Part Number 1: 603-RC0603FR-07200RL
R28 = RC0603FR-073KL: RES SMD 3K OHM 1% 1/10W 0603; Manufacturer: Yageo; Resistance: 3kR; Power Rating: 100mW; Voltage Rating: 50V; Temperature Coefficient: 100ppm/°C; Supplier 1: Mouser; Manufacturer Part Number: RC0603FR-073KL; Stock 1: 1106273; Pricing 1: 1=0.1, 10=0.018, 50=0.018, 100=0.006, 1000=0.005, 10000=0.003 (USD); Case/Package: 0603; Number of Pins: 2; Case Code (Imperial): 0603; Case Code (Metric): 1608; Min Operating Temperature: -55°C; Max Operating Temperature: 155°C; Tolerance: 1%; Packaging: Tape and Reel; Termination: SMD/SMT; Composition: Thick Film; Military Standard: Not; Voltage Rating (DC): 50V; Length: 1.6mm; Depth: 0.8mm; Width: 800um; REACH SVHC: No SVHC; Lead Free: Lead Free; Supplier Part Number 1: 603-RC0603FR-073KL
R32 = RC0603FR-07300KL: RES SMD 300K OHM 1% 1/10W 0603; Manufacturer: Yageo; Resistance: 300kR; Power Rating: 100mW; Temperature Coefficient: 100ppm/°C; Voltage Rating (DC): 50V; Supplier 1: Mouser; Manufacturer Part Number: RC0603FR-07300KL; Stock 1: 97844; Pricing 1: 1=0.1, 10=0.018, 50=0.018, 100=0.006, 1000=0.005, 10000=0.003 (USD); Mount: Surface Mount; Case/Package: 0603; Case Code (Metric): 1608; Case Code (Imperial): 0603; Min Operating Temperature: -55°C; Max Operating Temperature: 155°C; Tolerance: 1%; Packaging: Tape and Reel; Package Quantity: 1; Voltage Rating: 50V; Composition: Thick Film; Number of Terminations: 2; Termination: SMD/SMT; Military Standard: Not; Max Power Dissipation: 100mW; Features: Moisture Resistant; Length: 0.063inch; Height: 0.022inch; Width: 0.031inch; Depth: 0.8mm; Lead Free: Lead Free; ComponentLink1URL: http://www.yageo.com/documents/recent/PYu-RC_Group_51_RoHS_L_9.pdf?src-supplier=Digi-Key; ComponentLink1Description: http://www.yageo.com/documents/recent/PYu-RC_Group_51_RoHS_L_9.pdf?src-supplier=Digi-Key; ComponentLink2URL: http://www.yageo.com/documents/recent/PYu-RC_Group_51_RoHS_L_10.pdf?src-supplier=Digi-Key; ComponentLink2Description: http://www.yageo.com/documents/recent/PYu-RC_Group_51_RoHS_L_10.pdf?src-supplier=Digi-Key; ComponentLink3URL: https://www.verical.com/server-webapp/html/getDatasheet?partID=348071&src-supplier=Verical; ComponentLink3Description: https://www.verical.com/server-webapp/html/getDatasheet?partID=348071&src-supplier=Verical; Supplier Part Number 1: 603-RC0603FR-07300KL
R58 = RT0603FRE07910KL: High Precision-High Stability Chip Resistor Thin Film 0603 910kOhm 1% Paper T/R; Manufacturer: Yageo; Supplier 1: Mouser; Manufacturer Part Number: RT0603FRE07910KL; RoHS: Yes; Category: Chip SMD Resistors; Stock 1: 4473; Pricing 1: 1=0,10000, 10=0,07000, 50=0,07000, 100=0,02900, 1000=0,01300, 10000=0,00800 (USD); RoHS Compliant: Yes; Supplier Part Number 1: 603-RT0603FRE07910KL
R59 = RE0603FRE07200KL: Res Thick Film 0603 200K Ohm 1% 1/10W ±50ppm/°C Molded SMD Paper T/R; Manufacturer: Yageo; Resistance: 200kR; Max Power Dissipation: 100mW; Supplier 1: Mouser; Manufacturer Part Number: RE0603FRE07200KL; RoHS: Yes; Category: Chip SMD Resistors; Stock 1: 23235; Pricing 1: 1=0,10000, 10=0,03700, 50=0,03700, 100=0,01500, 1000=0,00700, 10000=0,00500 (USD); Case/Package: 0603; Min Operating Temperature: -55°C; Max Operating Temperature: 155°C; Packaging: Tape and Reel; Resistor Type: Thick Film; Number of Terminations: 2; Tolerance: 1%; Temperature Coefficient: 50ppm/°C; Features: Moisture Resistant; Length: 0.063inch; Width: 0.032inch; Height: 0.022inch; RoHS Compliant: Yes; ComponentLink1URL: http://www.yageo.com/NewPortal/yageodocoutput?fileName=/pdf/R-Chip/PYu-RE_105_RoHS_L_4.pdf&src-supplier=Digi-Key; ComponentLink1Description: http://www.yageo.com/NewPortal/yageodocoutput?fileName=/pdf/R-Chip/PYu-RE_105_RoHS_L_4.pdf&src-supplier=Digi-Key; Supplier Part Number 1: 603-RE0603FRE07200KL
RSENSE1 = LR2512-23R010F4: Low Resistors & Current Sense Resistors - Surface Mount 0.01Ohms ±1% 3W 2512 RoHS
SW3 = GBA Switch Original: Interruptor Original On OFF
TEST1 TEST4-TEST6 = PP_SMT_ROUND_2MM: Probe Pad, SMT, ROUND, 2.0MM
THR1 THR2 = NCP15XH103F03RC: THERMISTOR NTC 10KOHM 3380K 0402; Manufacturer: Murata Electronics North America; Resistance Tolerance: ±1%; B25/85: 3434K; B25/100: 3455K; Supplier 1: Digi-Key; Manufacturer Part Number: NCP15XH103F03RC; RoHS: RoHS Compliant; Category: Sensors, Transducers; Stock 1: 432156; Pricing 1: 1=0.11, 5=0.106, 10=0.094, 25=0.0868, 50=0.0696, 100=0.0596, 500=0.05216, 1000=0.04471, 5000=0.03974 (GBP); Packaging: Cut Tape (CT); Part Status: Active; Resistance in Ohms @ 25°C: 10k; B Value Tolerance: ±1%; B0/50: -; B25/50: 3380K; B25/75: -; Operating Temperature: -40°C ~ 125°C; Length - Lead Wire: -; Mounting Type: Surface Mount; Package / Case: 0402 (1005 Metric); ComponentLink1URL: https://www.murata.com/en-us/api/pdfdownloadapi?cate=&partno=NCP15XH103F03RC; ComponentLink1Description: https://www.murata.com/en-us/api/pdfdownloadapi?cate=&partno=NCP15XH103F03RC; Supplier Part Number 1: 490-4801-1-ND
TVS1 TVS2 = PESD5V0S1BA,115: PESD Series 14 V 45 pF Bi-Directional ESD Protection Diode - SOD-323; Manufacturer: Nexperia; Supplier 1: Mouser; Manufacturer Part Number: PESD5V0S1BA,115; RoHS: Yes; Category: ESD and Circuit Protection ICs; Pricing 1: 1=0,40000, 10=0,30800, 50=0,30800, 100=0,17500, 1000=0,08900, 10000=0,06900 (USD); RoHS Compliant: Yes; ComponentLink1URL: http://www.farnell.com/datasheets/461331.pdf?src-supplier=Farnell; ComponentLink1Description: http://www.farnell.com/datasheets/461331.pdf?src-supplier=Farnell; ComponentLink2URL: https://assets.nexperia.com/documents/data-sheet/PESD5V0S1BA_BB_BL.pdf?src-supplier=Digi-Key; ComponentLink2Description: https://assets.nexperia.com/documents/data-sheet/PESD5V0S1BA_BB_BL.pdf?src-supplier=Digi-Key
TVS3 = DESD5V0U1BA-7: TVSDIODE5VWM7.2VCSOD323; Manufacturer: Diodes; Number of Bidirectional Channels: 1; Min Breakdown Voltage: 5.5V; Clamping Voltage: 7.2V; Power Line Protection: No; Peak Pulse Current: 3A; Supplier 1: Mouser; Manufacturer Part Number: DESD5V0U1BA-7; RoHS: Yes; Category: TVS Diodes; Stock 1: 119202; Pricing 1: 1=0,26000, 10=0,21200, 50=0,21200, 100=0,11300, 1000=0,05100, 10000=0,03300 (USD); Mount: Surface Mount; Min Operating Temperature: -65°C; Max Operating Temperature: 150°C; Packaging: Tape and Reel; Reverse Standoff Voltage: 5V; Resistor Type: Zener; RoHS Compliant: Yes; ComponentLink1URL: http://www.farnell.com/datasheets/2814368.pdf?src-supplier=Farnell; ComponentLink1Description: http://www.farnell.com/datasheets/2814368.pdf?src-supplier=Farnell; ComponentLink2URL: http://www.mouser.com/ds/2/115/DESD5V0U1BA-756900.pdf?src-supplier=Mouser; ComponentLink2Description: http://www.mouser.com/ds/2/115/DESD5V0U1BA-756900.pdf?src-supplier=Mouser; ComponentLink3URL: http://www.farnell.com/datasheets/2814368.pdf?src-supplier=Newark; ComponentLink3Description: http://www.farnell.com/datasheets/2814368.pdf?src-supplier=Newark; ComponentLink4URL: http://www.farnell.com/datasheets/2814368.pdf?src-supplier=Element14; ComponentLink4Description: http://www.farnell.com/datasheets/2814368.pdf?src-supplier=Element14; ComponentLink5URL: https://www.diodes.com/assets/Datasheets/DESD5V0U1BA.pdf?src-supplier=Digi-Key; ComponentLink5Description: https://www.diodes.com/assets/Datasheets/DESD5V0U1BA.pdf?src-supplier=Digi-Key; Supplier Part Number 1: 621-DESD5V0U1BA-7
U2 = MAX17260SETD+: Gestión de baterías 5.1 A 1-Cell Fuel Gauge with ModelGauge m5 EZ and Optional High-SideCurrent Sensing; Manufacturer: Maxim Integrated; Empaquetado / Estuche: TDFN-EP-14; Producto: Fuel Gauges; Estilo de montaje: SMD/SMT; Tipo de batería: Li+, LiFePO4; CNHTS: 8542319000; Kit de desarrollo: MAX17260XEVKIT#; Temperatura operativa máxima: + 85 C; Temperatura operativa mínima: - 40 C; Corriente de suministro operativa: 15 uA; Voltaje operativo de suministro: 2.3 V to 4.9 V; Tipo de producto: Battery Management; Cantidad estándar de paquetes: 100; Subcategoría: PMIC - Power Management ICs; Product Status: New Product; Supplier 1: Mouser; Manufacturer Part Number: MAX17260SETD+; RoHS: RoHS Compliant; Category: Gestión de baterías; Stock 1: 287; Pricing 1: 1=1.96, 25=1.34, 50=1.09, 250=1.07, 1000=1.01 (EUR); Serie: MAX17260; Marca: Maxim Integrated; HTS Code: 8542390001; Fabricante: Maxim Integrated; RoHS - Mouser: Y; Minimum Order Quantity: 1; Reeling: False; ComponentLink1URL: http://www.mouser.com/datasheet/2/256/MAX17260-1369516.pdf; ComponentLink1Description: http://www.mouser.com/datasheet/2/256/MAX17260-1369516.pdf; Supplier Part Number 1: 700-MAX17260SETD+
U6 = MAX77757JEFG420+: Gestión de baterías 14V Input, 3A USB Type C Autonomous Charger; Manufacturer: Maxim; Supplier 1: Avnet; Manufacturer Part Number: MAX77757JEFG420+; RoHS: No; Pricing 1: 624=2,08051, 1248=2,01751, 2496=1,95451, 3744=1,89151, 4992=1,82851, 6240=1,76551, 62400=1,70251 (USD); Supplier Part Number 1: MAX77757JEFG420+
U7 = NX3DV221GM,115 (2): Analog Switch Single SPDT 10-Pin XQFN T/R; Manufacturer: NXP Semiconductors; Number of Inputs: 2; Number of Outputs: 4; Number of Channels: 1; Min Supply Voltage: 2.3V; Operating Supply Voltage: 3V; Max Supply Voltage: 3.6V; On-State Resistance: 7R; Operating Supply Current: 10nA; Power Dissipation: 250mW; Polarity: Non-Inverting; High Level Output Current: 120mA; Supplier 1: Mouser; Manufacturer Part Number: NX3DV221GM,115; RoHS: Yes; Category: Decoders and Multiplexers; Stock 1: 3680; Pricing 1: 1=0,98000, 10=0,85800, 50=0,85800, 100=0,65800, 1000=0,49100, 10000=0,49000 (USD); Mount: Surface Mount; Number of Pins: 10; Min Operating Temperature: -40°C; Max Operating Temperature: 85°C; Packaging: Tape and Reel; Package Quantity: 5000; Throw Configuration: SPDT; Supply Type: Single; Low Level Output Current: 120mA; Max Power Dissipation: 250mW; Series: -; Radiation Hardening: No; Lead Free: Lead Free; ComponentLink1URL: https://datasheet.ciiva.com/6637/nx3dv221-6637624.pdf?src-supplier=Digi-Key; ComponentLink1Description: https://datasheet.ciiva.com/6637/nx3dv221-6637624.pdf?src-supplier=Digi-Key; ComponentLink2URL: https://datasheet.ciiva.com/11581/nx3dv221-11581020.pdf?src-supplier=Avnet; ComponentLink2Description: https://datasheet.ciiva.com/11581/nx3dv221-11581020.pdf?src-supplier=Avnet; Supplier Part Number 1: 771-NX3DV221GM115
U9 = MIC2877-AYFT-TR: Conv DC-DC 2.5V to 5.5V Synchronous Step Up Single-Out 2.5V to 5.5V 2A 8-Pin FTQFN T/R; Manufacturer: Microchip; Supplier 1: Mouser; Manufacturer Part Number: MIC2877-AYFT-TR; RoHS: Yes; Category: Voltage Regulators - Switching; Stock 1: 4903; Pricing 1: 1=1,17000, 10=1,17000, 50=0,98600, 100=0,90000, 1000=0,90000, 10000=0,89900 (USD); Mount: Surface Mount; Number of Pins: 8; Packaging: Tape and Reel; RoHS Compliant: Yes; ComponentLink1URL: http://www.microchip.com/mymicrochip/filehandler.aspx?ddocname=en601345&src-supplier=Digi-Key; ComponentLink1Description: http://www.microchip.com/mymicrochip/filehandler.aspx?ddocname=en601345&src-supplier=Digi-Key; Supplier Part Number 1: 579-MIC2877-AYFT-TR
U12 = RP604K331A-TR: Dcdc Converter Ultra-low Quiesce; Manufacturer: Ricoh; Supplier 1: Mouser; Manufacturer Part Number: RP604K331A-TR; RoHS: No; Category: Voltage Regulators - Switching; Stock 1: 645
U13 = MMBZ5226B-7-F: Zener Diode Single 3.3V 5% 28Ohm 350mW 3-Pin SOT-23 T/R / DIODE ZENER 3.3V 350MW SOT23-3; Manufacturer: Diodes; Max Reverse Leakage Current: 25uA; Forward Voltage: 900mV; Impedance: 28R; Test Current: 20mA; ESD Protection: No; Supplier 1: Mouser; Manufacturer Part Number: MMBZ5226B-7-F; RoHS: Yes; Category: Zener Diodes; Stock 1: 7784; Pricing 1: 1=0,16000, 10=0,14500, 50=0,14500, 100=0,07900, 1000=0,03400, 10000=0,02200 (USD); Mount: Surface Mount; Case/Package: SOT-23-3; Number of Pins: 3; Weight: 0.000282oz; Contact Plating: Tin,Matte; Min Operating Temperature: -65°C; Max Operating Temperature: 150°C; Max Power Dissipation: 350mW; Zener Voltage: 3.3V; Packaging: Tape and Reel; Element Configuration: Single; Package Quantity: 3000; Tolerance: 5%; Voltage Tolerance: 5%; Power Dissipation: 350mW; Zener Current: 25uA; Working Voltage: 3.3V; Max Reverse Current: 25uA; Termination: SMD/SMT; Power Rating: 350mW; Voltage Rating (DC): 3.3V; Series: -; Length: 2.9mm; Width: 2.4mm; Height: 1mm; Radiation Hardening: No; Lead Free: Lead Free; RoHS Compliant: Yes; ComponentLink1URL: https://datasheet.ciiva.com/10643/ds18011-10643287.pdf?src-supplier=Avnet; ComponentLink1Description: https://datasheet.ciiva.com/10643/ds18011-10643287.pdf?src-supplier=Avnet; Supplier Part Number 1: 621-MMBZ5226B-F

## Nets that join several sheets
3V3_SYS: [04] - Display & Pi Zero & USB Host (34 pins), [07] - USB-hub (16 pins), [03] - MCU (29 pins), [05] - Power (6 pins)
5V_SYS: [04] - Display & Pi Zero & USB Host (5 pins), [06] - Audio (9 pins), [05] - Power (5 pins)
CSN: [04] - Display & Pi Zero & USB Host (24 pins), [07] - USB-hub (19 pins), [06] - Audio (25 pins), [03] - MCU (36 pins), [05] - Power (59 pins)
BTN_PRESS: [03] - MCU (U3.13), [05] - Power (Q2.3 R27.1 TEST4.1)
CTRL_WLED: [04] - Display & Pi Zero & USB Host (R25.2 U10.4), [03] - MCU (U3.29)
ENBST: [03] - MCU (U3.34), [05] - Power (R13.2 U6.8 U7.9)
GPIO_STH: [03] - MCU (U3.32), [05] - Power (C63.1 Q4.1 R35.2 TEST5.1)
LED_ST: [03] - MCU (U3.14), [05] - Power (L3.1)
MUTE: [06] - Audio (U8.22), [03] - MCU (U3.35)
ON_OFF_RPI: [03] - MCU (U3.30), [05] - Power (R10.2 U9.6)
POST_DR_DAC_N: [07] - USB-hub (U5.6), [06] - Audio (R16.1)
POST_DR_DAC_P: [07] - USB-hub (U5.7), [06] - Audio (R15.2 R17.1)
RESET_LCD: [04] - Display & Pi Zero & USB Host (FPC1.8 R52.1), [03] - MCU (U3.27)
RPI_GPIO7: [04] - Display & Pi Zero & USB Host (J68.9 R39.2), [03] - MCU (U3.9)
RPI_GPIO8: [03] - MCU (R48.1 U3.11), [05] - Power (U2.13)
RPI_GPIO9: [03] - MCU (R49.1 U3.12), [05] - Power (U2.14)
RPI_GPIO13: [07] - USB-hub (C12.1 R5.1 TEST17.1 U5.26), [03] - MCU (U3.16)
RPI_GPIO24: [06] - Audio (U8.23), [03] - MCU (U3.36)
RPI_GPIO25: [06] - Audio (U8.24), [03] - MCU (U3.37)
RPI_USB_N: [04] - Display & Pi Zero & USB Host (U1.DM), [07] - USB-hub (U5.30)
RPI_USB_P: [04] - Display & Pi Zero & USB Host (U1.DP), [07] - USB-hub (U5.31)
USB_D2_N: [07] - USB-hub (U5.3), [05] - Power (U7.4)
USB_D2_P: [07] - USB-hub (U5.4), [05] - Power (U7.3)
USB_OUT_PICO_N: [07] - USB-hub (U5.1), [03] - MCU (R47.1)
USB_OUT_PICO_P: [07] - USB-hub (U5.2), [03] - MCU (R46.1)